# EAGLE design ADG_919 (EAGLE 9.3.0)
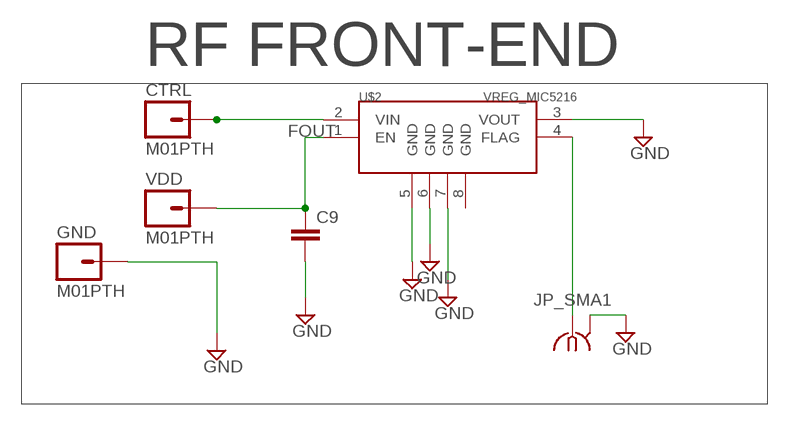
[diagram p0: schematic, sheet 1]

## Parts
C9  CAP0603-CAP  [0603-CAP]
CTRL  M01PTH  [1X01]
GND  M01PTH  [1X01]
JP_SMA1  SMA-142-0701-881/886  [J502-ND-142-0701-881/886]
U$2  VREG_MIC5216  [MSOP8]
VDD  M01PTH  [1X01]

## Nets
FOUT: CTRL.1 U$2.2(VIN)
GND: C9.2 GND.1 JP_SMA1.G@1 JP_SMA1.G@2 JP_SMA1.G@3 JP_SMA1.G@4 U$2.3(VOUT) U$2.5(GND) U$2.6(GND) U$2.7(GND)
N$3: C9.1 U$2.1(EN) VDD.1
N$4: JP_SMA1.1 U$2.4(FLAG)
Unconnected: U$2.8(GND)

## Notes on the sheet
- RF FRONT-END

## Library data of the parts
C9 = SparkFun-Capacitors:CAP: Capacitor Standard 0603 ceramic capacitor, and 0.1" leaded capacitor.
CTRL GND VDD = SparkFun:M01: Header 1 Standard 1-pin 0.1" header. Use with straight break away headers (SKU : PRT-00116), right angle break away headers (PRT-00553), swiss pins (PRT-00743), machine pins (PRT-00117), and female headers (PRT-00115).
JP_SMA1 = con-coax:SMA-: SMA 50 Ohm End Launch Jack Receptacle - Round Contact Johnson Components Source: www.johnsoncomponents.com .. J502-ND.pdf; MF: JOHNSON COMPONENTS; MPN: 142-0701-881; OC_FARNELL: 1608603; OC_NEWARK: 08B906
U$2 = SparkFun:VREG_MIC5216: 500mA LDO, MSOP8 for better dissipation

## Board
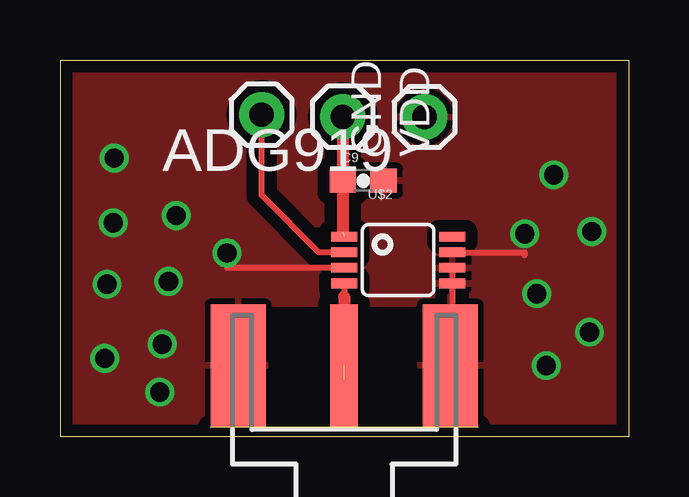
[diagram p1: board, top side]
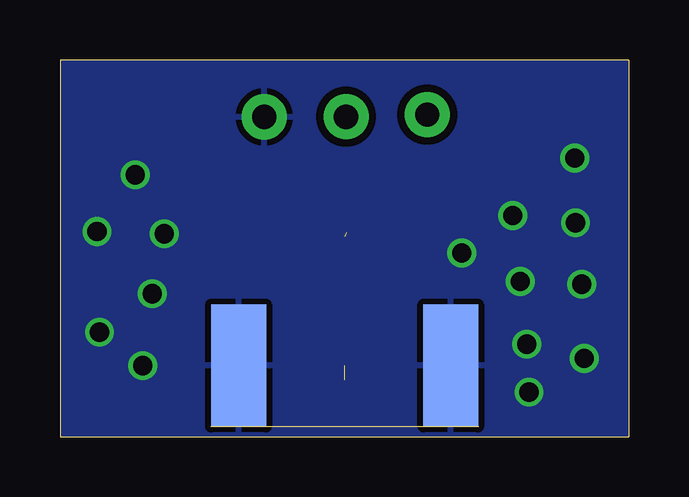
[diagram p2: board, bottom side, seen from below]

Size 23.7 x 15.73 mm. Coordinates in mm from the lower left corner, seen from the top.
Outline: 0,15.73 23.69,15.73 23.7,0.01 0.01,0 0,15.73
Copper layers (1*16): Top 0.035mm / dielectric 1.5mm / Bottom 0.035mm
Design rules "Fusion_eagle_rule_v1.1 *": minimum track width 10mil, minimum drill 12mil, track to track 12mil, track to pad 12mil, pad to pad 12mil, via to via 12mil, smd to smd 0mil, copper to edge 1mil, drill to drill 10mil, minimum pad ring 10mil, minimum via ring 6mil, stop-mask expansion 2mil, vias tented up to drill 100mil, thermal gap 10mil

### Footprints (pad centres in the part's own frame; a part is rotated, then mirrored left to right if it is on the bottom)
0603-CAP = smd 1.1 x 1: 1 -0.85,0; 2 0.85,0
1X01 = drill 1.016 pad 1.88: 1 0,0
J502-ND-142-0701-881/886 = smd 5.08 x 1.143: 1 2.565,0 | smd 5.08 x 2.286: G@1 2.565,4.42; G@2 2.565,-4.42 | smd 5.08 x 2.286 bottom: G@3 2.565,4.42; G@4 2.565,-4.42
MSOP8 = smd 0.4 x 1.1: 1 -0.975,-2.25; 2 -0.325,-2.25; 3 0.325,-2.25; 4 0.975,-2.25; 5 0.975,2.25; 6 0.325,2.25; 7 -0.325,2.25; 8 -0.975,2.25

### Placement (x,y rotation side)
C9  12.63,10.69 0 top
CTRL  8.4,13.44 0 top
GND  15.19,13.35 0 top
JP_SMA1  11.84,0.42 90 top
U$2  14.09,7.38 270 top
VDD  11.78,13.36 0 top

### Tracks (layer width: path | path; a pad name or v marks a point on that pad's centre or on a via)
FOUT
  Top 0.254: U$2.2 10.78,7.7 8.4,10.08 CTRL.1
GND  (via drill 0.8)
  Top 0.254: U$2.7 19.36,7.7 19.36,7.57 | U$2.3 6.96,7.05 6.96,7.07 | 16.34,2.98 JP_SMA1.G@4 | U$2.6 U$2.5 16.34,3.81 16.35,3.8
  other vias: 4.84,9.23 2.22,8.93 6.96,7.67 1.96,6.37 1.86,3.27 4.26,3.87 4.16,1.87 20.57,10.93 19.36,8.47 22.16,8.57 19.86,5.97 22.06,4.37 20.26,2.97 2.26,11.63 4.52,6.48
  pour Top (isolate 0.508): 0.21,15.68 -0.03,-0.06 8.55,0.02 8.55,5.56 15.05,5.56 14.94,0 23.76,0.02 23.76,15.71
  pour Bottom: -0.74,15.71 -0.74,-0.83 25.06,-0.83 25.16,-0.73 25.16,15.71
N$3  (1 unrouted)
  Top 0.508: VDD.1 C9.1 | C9.1 | C9.1 11.78,8.52
  Top 0.813: VDD.1 11.72,13.36
N$4  (1 unrouted)
  Top 0.254: U$2.4 11.84,5.86 11.84,5.85
  Top 0.406: 11.81,4.42 11.76,4.42 11.76,3.72 12.01,3.72 12.01,2.37 11.84,2.37
  Top 0.508: 11.84,5.85 11.84,4.45 11.81,4.42

### Text on the board
tPlace: ADG919